# Altium schematic sheet Traffic_Light.SchDoc
size 330 x 304 mm; SheetNumber: 1; SheetTotal: 1; SPICEModelCacheIHBRXWNM: <root> / <DocumentId>IHBRXWNM</DocumentId> / </root>
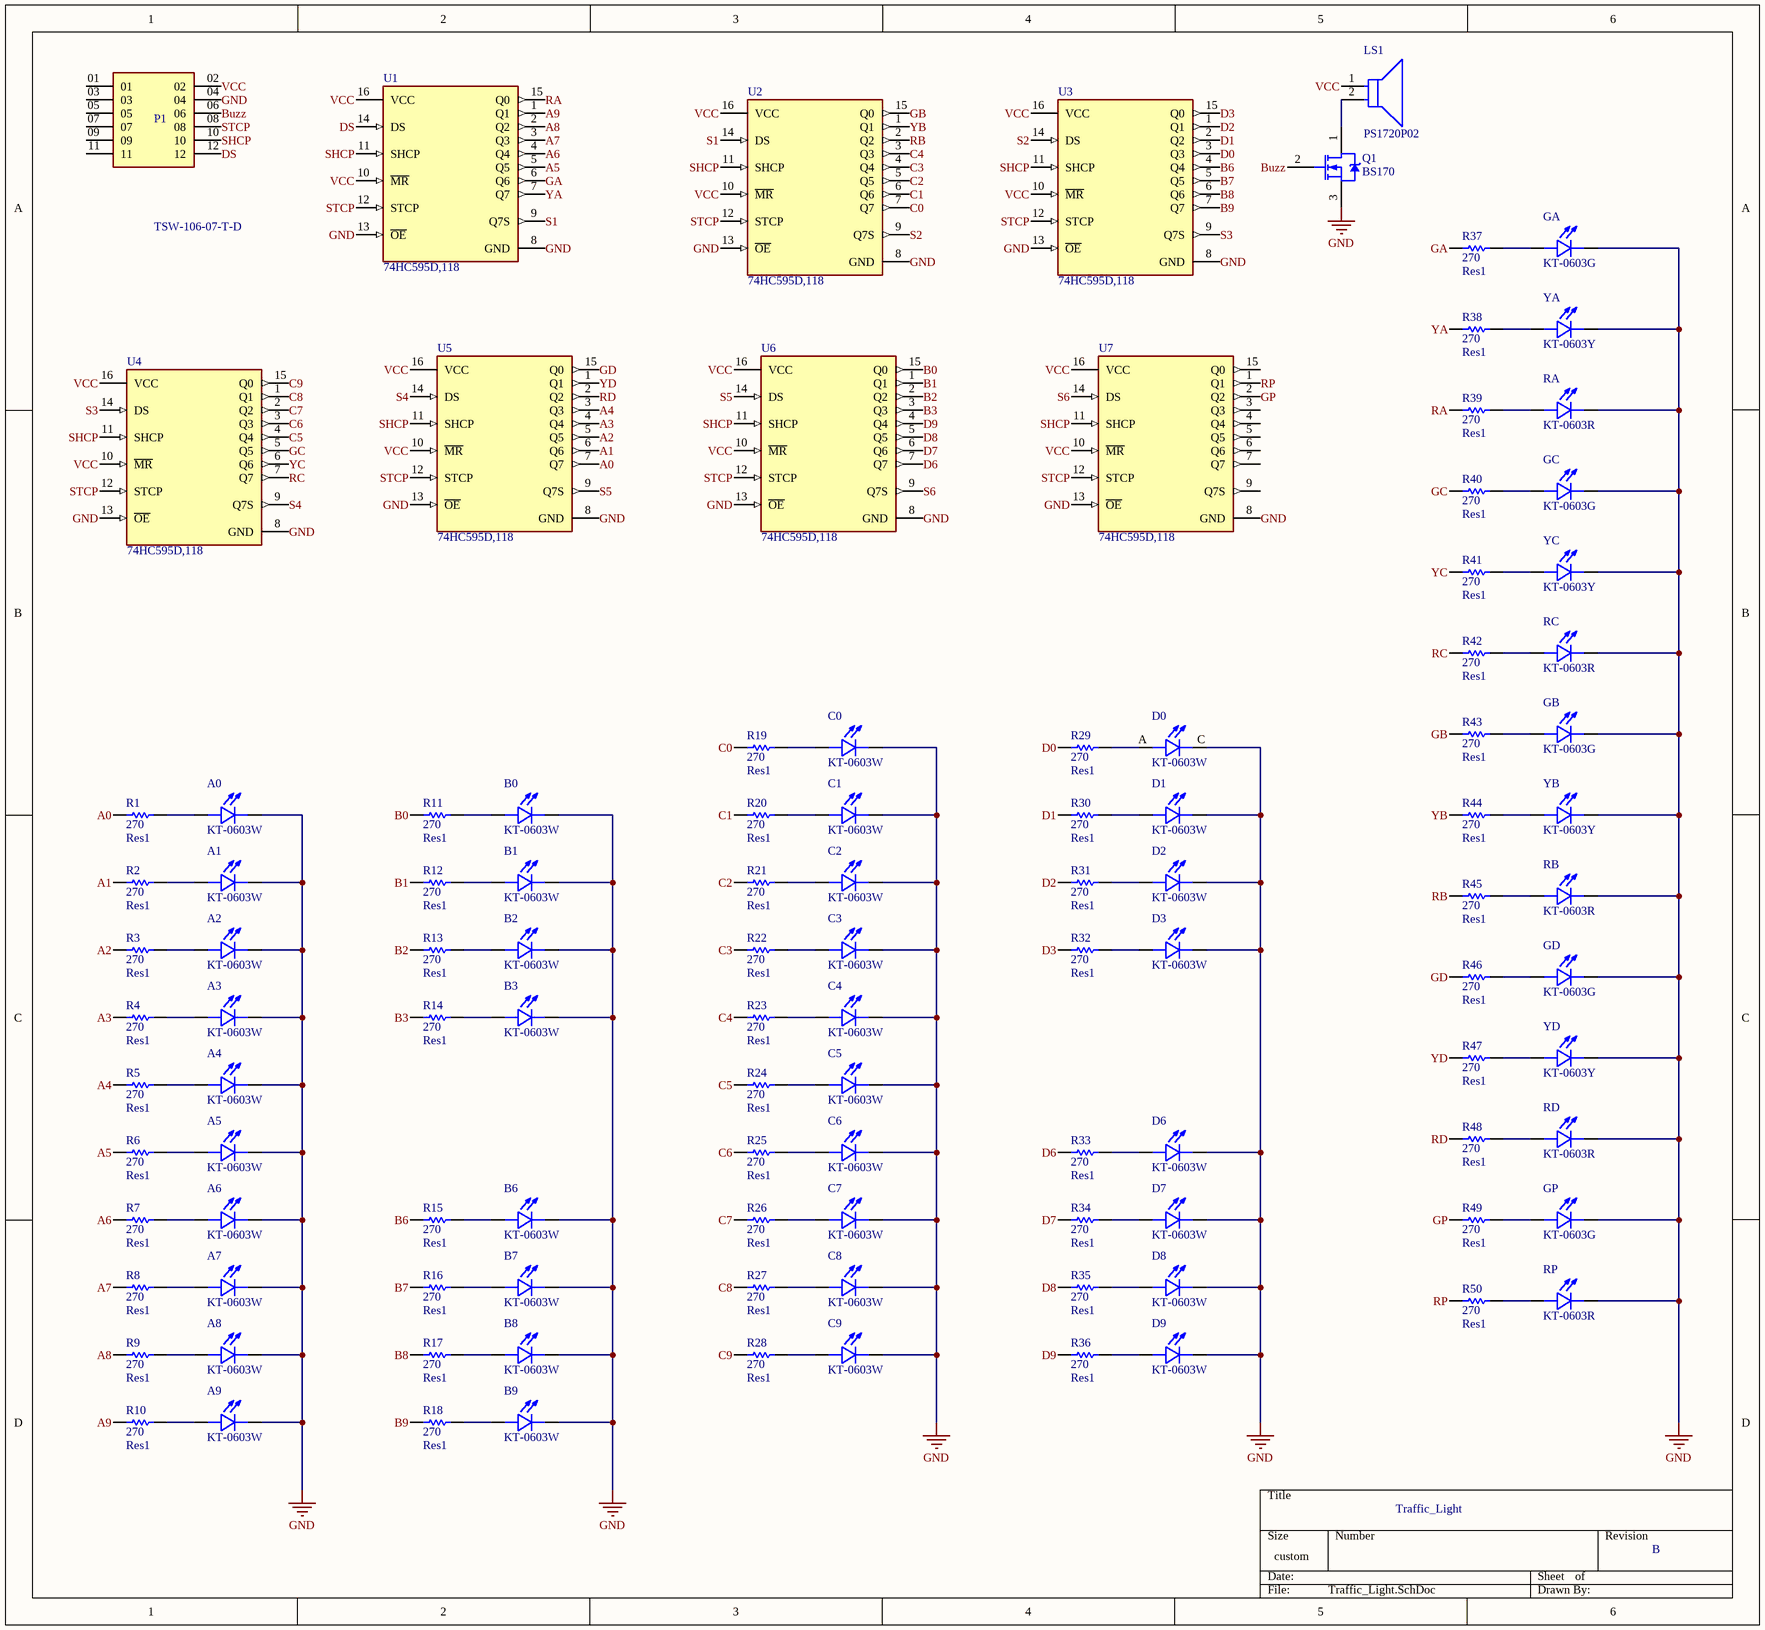
[diagram p0: Traffic_Light.SchDoc]

## Parts
A0  KT-0603W  [LED_KT-0603R]
A1  KT-0603W  [LED_KT-0603R]
A2  KT-0603W  [LED_KT-0603R]
A3  KT-0603W  [LED_KT-0603R]
A4  KT-0603W  [LED_KT-0603R]
A5  KT-0603W  [LED_KT-0603R]
A6  KT-0603W  [LED_KT-0603R]
A7  KT-0603W  [LED_KT-0603R]
A8  KT-0603W  [LED_KT-0603R]
A9  KT-0603W  [LED_KT-0603R]
B0  KT-0603W  [LED_KT-0603R]
B1  KT-0603W  [LED_KT-0603R]
B2  KT-0603W  [LED_KT-0603R]
B3  KT-0603W  [LED_KT-0603R]
B6  KT-0603W  [LED_KT-0603R]
B7  KT-0603W  [LED_KT-0603R]
B8  KT-0603W  [LED_KT-0603R]
B9  KT-0603W  [LED_KT-0603R]
C0  KT-0603W  [LED_KT-0603R]
C1  KT-0603W  [LED_KT-0603R]
C2  KT-0603W  [LED_KT-0603R]
C3  KT-0603W  [LED_KT-0603R]
C4  KT-0603W  [LED_KT-0603R]
C5  KT-0603W  [LED_KT-0603R]
C6  KT-0603W  [LED_KT-0603R]
C7  KT-0603W  [LED_KT-0603R]
C8  KT-0603W  [LED_KT-0603R]
C9  KT-0603W  [LED_KT-0603R]
D0  KT-0603W  [LED_KT-0603R]
D1  KT-0603W  [LED_KT-0603R]
D2  KT-0603W  [LED_KT-0603R]
D3  KT-0603W  [LED_KT-0603R]
D6  KT-0603W  [LED_KT-0603R]
D7  KT-0603W  [LED_KT-0603R]
D8  KT-0603W  [LED_KT-0603R]
D9  KT-0603W  [LED_KT-0603R]
GA  KT-0603G  [LED_KT-0603R]
GB  KT-0603G  [LED_KT-0603R]
GC  KT-0603G  [LED_KT-0603R]
GD  KT-0603G  [LED_KT-0603R]
GP  KT-0603G  [LED_KT-0603R]
LS1  PS1720P02  [FP-PS1720P02-MFG]
P1  TSW-106-07-T-D  [SAMTEC_TSW-106-07-T-D]
Q1  BS170  [ONSC-TO-92-3-29-11]
R1  Res1  value 270  [RESC1608X55N]
R2  Res1  value 270  [RESC1608X55N]
R3  Res1  value 270  [RESC1608X55N]
R4  Res1  value 270  [RESC1608X55N]
R5  Res1  value 270  [RESC1608X55N]
R6  Res1  value 270  [RESC1608X55N]
R7  Res1  value 270  [RESC1608X55N]
R8  Res1  value 270  [RESC1608X55N]
R9  Res1  value 270  [RESC1608X55N]
R10  Res1  value 270  [RESC1608X55N]
R11  Res1  value 270  [RESC1608X55N]
R12  Res1  value 270  [RESC1608X55N]
R13  Res1  value 270  [RESC1608X55N]
R14  Res1  value 270  [RESC1608X55N]
R15  Res1  value 270  [RESC1608X55N]
R16  Res1  value 270  [RESC1608X55N]
R17  Res1  value 270  [RESC1608X55N]
R18  Res1  value 270  [RESC1608X55N]
R19  Res1  value 270  [RESC1608X55N]
R20  Res1  value 270  [RESC1608X55N]
R21  Res1  value 270  [RESC1608X55N]
R22  Res1  value 270  [RESC1608X55N]
R23  Res1  value 270  [RESC1608X55N]
R24  Res1  value 270  [RESC1608X55N]
R25  Res1  value 270  [RESC1608X55N]
R26  Res1  value 270  [RESC1608X55N]
R27  Res1  value 270  [RESC1608X55N]
R28  Res1  value 270  [RESC1608X55N]
R29  Res1  value 270  [RESC1608X55N]
R30  Res1  value 270  [RESC1608X55N]
R31  Res1  value 270  [RESC1608X55N]
R32  Res1  value 270  [RESC1608X55N]
R33  Res1  value 270  [RESC1608X55N]
R34  Res1  value 270  [RESC1608X55N]
R35  Res1  value 270  [RESC1608X55N]
R36  Res1  value 270  [RESC1608X55N]
R37  Res1  value 270  [RESC1608X55N]
R38  Res1  value 270  [RESC1608X55N]
R39  Res1  value 270  [RESC1608X55N]
R40  Res1  value 270  [RESC1608X55N]
R41  Res1  value 270  [RESC1608X55N]
R42  Res1  value 270  [RESC1608X55N]
R43  Res1  value 270  [RESC1608X55N]
R44  Res1  value 270  [RESC1608X55N]
R45  Res1  value 270  [RESC1608X55N]
R46  Res1  value 270  [RESC1608X55N]
R47  Res1  value 270  [RESC1608X55N]
R48  Res1  value 270  [RESC1608X55N]
R49  Res1  value 270  [RESC1608X55N]
R50  Res1  value 270  [RESC1608X55N]
RA  KT-0603R  [LED_KT-0603R]
RB  KT-0603R  [LED_KT-0603R]
RC  KT-0603R  [LED_KT-0603R]
RD  KT-0603R  [LED_KT-0603R]
RP  KT-0603R  [LED_KT-0603R]
U1  74HC595D,118  [FP-SOT109-1-IPC_C]
U2  74HC595D,118  [FP-SOT109-1-IPC_C]
U3  74HC595D,118  [FP-SOT109-1-IPC_C]
U4  74HC595D,118  [FP-SOT109-1-IPC_C]
U5  74HC595D,118  [FP-SOT109-1-IPC_C]
U6  74HC595D,118  [FP-SOT109-1-IPC_C]
U7  74HC595D,118  [FP-SOT109-1-IPC_C]
YA  KT-0603Y  [LED_KT-0603R]
YB  KT-0603Y  [LED_KT-0603R]
YC  KT-0603Y  [LED_KT-0603R]
YD  KT-0603Y  [LED_KT-0603R]

## Nets
GND: A0.C A1.C A2.C A3.C A4.C A5.C A6.C A7.C A8.C A9.C B0.C B1.C B2.C B3.C B6.C B7.C B8.C B9.C C0.C C1.C C2.C C3.C C4.C C5.C C6.C C7.C C8.C C9.C D0.C D1.C D2.C D3.C D6.C D7.C D8.C D9.C GA.C GB.C GC.C GD.C GP.C P1.04 Q1.3(S) RA.C RB.C RC.C RD.C RP.C U1.8(GND) U1.13(~{OE}) U2.8(GND) U2.13(~{OE}) U3.8(GND) U3.13(~{OE}) U4.8(GND) U4.13(~{OE}) U5.8(GND) U5.13(~{OE}) U6.8(GND) U6.13(~{OE}) U7.8(GND) U7.13(~{OE}) YA.C YB.C YC.C YD.C
A0: R1.1 U5.7(Q7)
A1: R2.1 U5.6(Q6)
A2: R3.1 U5.5(Q5)
A3: R4.1 U5.4(Q4)
A4: R5.1 U5.3(Q3)
A5: R6.1 U1.5(Q5)
A6: R7.1 U1.4(Q4)
A7: R8.1 U1.3(Q3)
A8: R9.1 U1.2(Q2)
A9: R10.1 U1.1(Q1)
B0: R11.1 U6.15(Q0)
B1: R12.1 U6.1(Q1)
B2: R13.1 U6.2(Q2)
B3: R14.1 U6.3(Q3)
B6: R15.1 U3.4(Q4)
B7: R16.1 U3.5(Q5)
B8: R17.1 U3.6(Q6)
B9: R18.1 U3.7(Q7)
Buzz: P1.06 Q1.2(G)
C0: R19.1 U2.7(Q7)
C1: R20.1 U2.6(Q6)
C2: R21.1 U2.5(Q5)
C3: R22.1 U2.4(Q4)
C4: R23.1 U2.3(Q3)
C5: R24.1 U4.4(Q4)
C6: R25.1 U4.3(Q3)
C7: R26.1 U4.2(Q2)
C8: R27.1 U4.1(Q1)
C9: R28.1 U4.15(Q0)
D0: R29.1 U3.3(Q3)
D1: R30.1 U3.2(Q2)
D2: R31.1 U3.1(Q1)
D3: R32.1 U3.15(Q0)
D6: R33.1 U6.7(Q7)
D7: R34.1 U6.6(Q6)
D8: R35.1 U6.5(Q5)
D9: R36.1 U6.4(Q4)
DS: P1.12 U1.14(DS)
GA: R37.1 U1.6(Q6)
GB: R43.1 U2.15(Q0)
GC: R40.1 U4.5(Q5)
GD: R46.1 U5.15(Q0)
GP: R49.1 U7.2(Q2)
RA: R39.1 U1.15(Q0)
RB: R45.1 U2.2(Q2)
RC: R42.1 U4.7(Q7)
RD: R48.1 U5.2(Q2)
RP: R50.1 U7.1(Q1)
S1: U1.9(Q7S) U2.14(DS)
S2: U2.9(Q7S) U3.14(DS)
S3: U3.9(Q7S) U4.14(DS)
S4: U4.9(Q7S) U5.14(DS)
S5: U5.9(Q7S) U6.14(DS)
S6: U6.9(Q7S) U7.14(DS)
SHCP: P1.10 U1.11(SHCP) U2.11(SHCP) U3.11(SHCP) U4.11(SHCP) U5.11(SHCP) U6.11(SHCP) U7.11(SHCP)
STCP: P1.08 U1.12(STCP) U2.12(STCP) U3.12(STCP) U4.12(STCP) U5.12(STCP) U6.12(STCP) U7.12(STCP)
VCC: LS1.1 P1.02 U1.10(~{MR}) U1.16(VCC) U2.10(~{MR}) U2.16(VCC) U3.10(~{MR}) U3.16(VCC) U4.10(~{MR}) U4.16(VCC) U5.10(~{MR}) U5.16(VCC) U6.10(~{MR}) U6.16(VCC) U7.10(~{MR}) U7.16(VCC)
YA: R38.1 U1.7(Q7)
YB: R44.1 U2.1(Q1)
YC: R41.1 U4.6(Q6)
YD: R47.1 U5.1(Q1)
NetA0_A: A0.A R1.2
NetA1_A: A1.A R2.2
NetA2_A: A2.A R3.2
NetA3_A: A3.A R4.2
NetA4_A: A4.A R5.2
NetA5_A: A5.A R6.2
NetA6_A: A6.A R7.2
NetA7_A: A7.A R8.2
NetA8_A: A8.A R9.2
NetA9_A: A9.A R10.2
NetB0_A: B0.A R11.2
NetB1_A: B1.A R12.2
NetB2_A: B2.A R13.2
NetB3_A: B3.A R14.2
NetB6_A: B6.A R15.2
NetB7_A: B7.A R16.2
NetB8_A: B8.A R17.2
NetB9_A: B9.A R18.2
NetC0_A: C0.A R19.2
NetC1_A: C1.A R20.2
NetC2_A: C2.A R21.2
NetC3_A: C3.A R22.2
NetC4_A: C4.A R23.2
NetC5_A: C5.A R24.2
NetC6_A: C6.A R25.2
NetC7_A: C7.A R26.2
NetC8_A: C8.A R27.2
NetC9_A: C9.A R28.2
NetD0_A: D0.A R29.2
NetD1_A: D1.A R30.2
NetD2_A: D2.A R31.2
NetD3_A: D3.A R32.2
NetD6_A: D6.A R33.2
NetD7_A: D7.A R34.2
NetD8_A: D8.A R35.2
NetD9_A: D9.A R36.2
NetGA_A: GA.A R37.2
NetGB_A: GB.A R43.2
NetGC_A: GC.A R40.2
NetGD_A: GD.A R46.2
NetGP_A: GP.A R49.2
NetLS1_2: LS1.2 Q1.1(D)
NetR38_2: R38.2 YA.A
NetR39_2: R39.2 RA.A
NetR41_2: R41.2 YC.A
NetR42_2: R42.2 RC.A
NetR44_2: R44.2 YB.A
NetR45_2: R45.2 RB.A
NetR47_2: R47.2 YD.A
NetR48_2: R48.2 RD.A
NetR50_2: R50.2 RP.A

Not connected (* = marked no-connect by the designer): P1 01 03 05 07 09 11; U7 3(Q3) 4(Q4) 5(Q5) 6(Q6) 7(Q7) 9(Q7S) 15(Q0)

## Notes on the sheet
- Traffic_Light
- B

## Library data of the parts
A0-A9 B0-B3 B6-B9 C0-C9 D0-D3 D6-D9 = KT-0603R: White 0603 Light Emitting Diodes; MF: Hubei KENTO Elec; SnapEDA_Link: https://www.snapeda.com/parts/KT-0603R/Hubei+KENTO+Elec/view-part/?ref=snap; Package: Package; Value: *; MP: KT-0603W; Check_prices: https://www.snapeda.com/parts/KT-0603R/Hubei+KENTO+Elec/view-part/?ref=eda; JLCPCB Part: C2290
GA GB GC GD GP = KT-0603R: Green 0603 Light Emitting Diodes; MF: Hubei KENTO Elec; SnapEDA_Link: https://www.snapeda.com/parts/KT-0603R/Hubei+KENTO+Elec/view-part/?ref=snap; Package: Package; Value: *; MP: KT-0603G; Check_prices: https://www.snapeda.com/parts/KT-0603R/Hubei+KENTO+Elec/view-part/?ref=eda; JLCPCB Part: C12624
LS1 = CMP-08413-000001-1: AUDIO PIEZO TRANSDUCER 30V TH; Manufacturer: TDK Corporation; Frequency: 2kHz; Standoff Height: 0.5mm; RoHS: TRUE; ComponentLink2URL: https://product.tdk.com/info/en/catalog/datasheets/piezoelectronic_buzzer_ps_en.pdf; ComponentLink2Description: Datasheet; Lead Free: Yes; Temperature Range High: +70°C; Category: Speak; Height: 8.3mm; Device Class L1: Electromechanical; Device Class L3: Buzzers; Package: 0; Mouser Description: Audio Indicators & Alerts Round 17mmx8mm 2 kHz Vin=3V; Manufacturer Part Number: PS1720P02; Digikey Description: AUDIO PIEZO TRANSDUCER 30V TH; Device Class L2: Audio Products; Temperature Range Low: -10°C; Automotive: No; Octopart: https://octopart.com/ps1720p02-tdk-154429; Temperature: -10°C to +70°C
P1 = TSW-106-07-T-D: TSW - Samtec 2.54mm Pin Header 10.92mm Overall Pin Length (07) - Fast Stock; Value: *; Purchase-URL: https://pricing.snapeda.com/search/part/TSW-106-07-T-D/?ref=eda; MF: Samtec; MP: TSW-106-07-T-D; Price: None; Check_prices: https://www.snapeda.com/parts/TSW-106-07-T-D/Samtec/view-part/2815469/?ref=eda; Package: None; Availability: In Stock; SnapEDA_Link: https://www.snapeda.com/parts/TSW-106-07-T-D/Samtec/view-part/2815469/?ref=snap; Supplier 1: RS; Supplier Part Number 1: 1802231
Q1 = CMP-1058-00929-1: Small Signal MOSFET, 500 mA, 60 V, N-Channel, 3-Pin TO-92, Bulk Box; Manufacturer: On Semiconductor; VGS Max (V): 20; Configuration: Single; PD Max (W): 0.35; VGS(th) Max (V): 3; ID Max (A): 0.5; V(BR)DSS Min (V): 60; Channel Polarity: N Channel; PackageDescription: 3-Pin Transistor Outline, Body 4.825 x 3.685 mm, Pitch 1.27 mm; Package Type: TO-92; ComponentLink1Description: Manufacturer URL; ComponentLink1URL: http://www.onsemi.com/; DatasheetVersion: Rev. 6; ComponentLink3Description: Package Specification; PartNumber: BS170; ComponentLink2URL: http://www.onsemi.com/pub_link/Collateral/BS170-D.PDF; PackageVersion: Rev. AM; Mounting Technology: Through Hole; PackageReference: TO-92-3-29-11_AM_SL; ComponentLink2Description: Datasheet; ComponentLink3URL: http://www.onsemi.cn/pub_link/Collateral/2N6426-D.PDF; Packing: Bulk Box
R1-R50 = Res1: resistor; Published: 8-Jun-2000; LatestRevisionDate: 17-Jul-2002; LatestRevisionNote: Re-released for DXP Platform.; PackageReference: AXIAL-0.3; Publisher: Altium Limited; PackageDescription: Axial Device, Thru-Hole; 2 Leads; 0.3 in Pin Spacing; Supplier 1: Farnell; Supplier Part Number 1: CFR-25JB-52-270R; JLCPCB Part: C22966
  R1-R28 R30-R50: Parameter 4: *; Parameter 5: *
RA RB RC RD RP = KT-0603R: Red 0603 Light Emitting Diodes; MF: Hubei KENTO Elec; SnapEDA_Link: https://www.snapeda.com/parts/KT-0603R/Hubei+KENTO+Elec/view-part/?ref=snap; Package: Package; Value: *; MP: KT-0603R; Check_prices: https://www.snapeda.com/parts/KT-0603R/Hubei+KENTO+Elec/view-part/?ref=eda; JLCPCB Part: C2286
U1-U7 = CMP-14351-000006-1: IC SHIFT REGISTER 8BIT 16SOIC; RoHS Compliant: Yes; JLCPCB Part: C5947
YA YB YC YD = KT-0603R: Yellow 0603 Light Emitting Diodes; MF: Hubei KENTO Elec; SnapEDA_Link: https://www.snapeda.com/parts/KT-0603R/Hubei+KENTO+Elec/view-part/?ref=snap; Package: Package; Value: *; MP: KT-0603R; Check_prices: https://www.snapeda.com/parts/KT-0603R/Hubei+KENTO+Elec/view-part/?ref=eda; JLCPCB Part: C2287